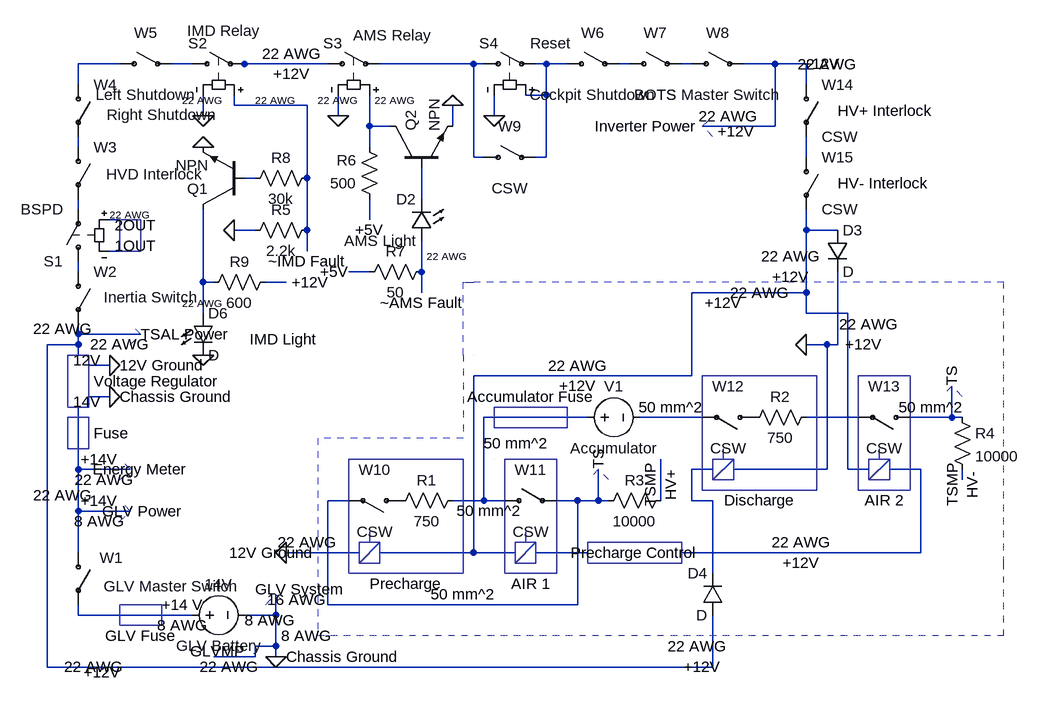
[diagram p0: schematic RM27 Shutdown Circuit 04_05_2024.asc]
RM27 Shutdown Circuit 04_05_2024.asc, the LTspice schematic file:
Version 4
SHEET 1 1548 680
WIRE 48 -672 -16 -672
WIRE 160 -672 128 -672
WIRE 240 -672 224 -672
WIRE 368 -672 240 -672
WIRE 592 -672 448 -672
WIRE 608 -672 592 -672
WIRE 704 -672 688 -672
WIRE 736 -672 704 -672
WIRE 832 -672 816 -672
WIRE 928 -672 912 -672
WIRE 1056 -672 1008 -672
WIRE 1104 -672 1056 -672
WIRE -16 -640 -16 -672
WIRE 1104 -640 1104 -672
WIRE 704 -624 704 -672
WIRE 704 -624 672 -624
WIRE 224 -608 224 -624
WIRE 336 -608 224 -608
WIRE 176 -592 176 -624
WIRE 384 -592 384 -624
WIRE 624 -592 624 -624
WIRE 432 -576 432 -624
WIRE 464 -576 432 -576
WIRE 560 -576 560 -608
WIRE 1056 -576 1056 -672
WIRE 1056 -576 944 -576
WIRE -16 -544 -16 -560
WIRE 432 -544 432 -576
WIRE 592 -528 592 -672
WIRE 608 -528 592 -528
WIRE 704 -528 704 -624
WIRE 704 -528 688 -528
WIRE 1104 -528 1104 -560
WIRE 256 -496 240 -496
WIRE 336 -496 336 -608
WIRE 512 -464 512 -512
WIRE -16 -448 -16 -464
WIRE 48 -432 32 -432
WIRE 432 -432 432 -464
WIRE 256 -416 224 -416
WIRE 336 -416 336 -496
WIRE 1104 -416 1104 -448
WIRE 1152 -416 1104 -416
WIRE 48 -384 32 -384
WIRE 336 -384 336 -416
WIRE -16 -352 -16 -368
WIRE 432 -352 400 -352
WIRE 512 -352 512 -400
WIRE 176 -336 176 -448
WIRE 192 -336 176 -336
WIRE 304 -336 272 -336
WIRE 512 -320 512 -352
WIRE 1104 -320 1104 -416
WIRE 1104 -320 928 -320
WIRE 176 -288 176 -336
WIRE 1104 -288 1104 -320
WIRE 1168 -288 1104 -288
WIRE -16 -256 -16 -272
WIRE 80 -256 -16 -256
WIRE -16 -240 -16 -256
WIRE -16 -240 -64 -240
WIRE 1136 -240 1104 -240
WIRE 1152 -240 1152 -352
WIRE 1152 -240 1136 -240
WIRE -16 -224 -16 -240
WIRE 32 -208 0 -208
WIRE 928 -192 928 -320
WIRE 928 -192 592 -192
WIRE 32 -160 0 -160
WIRE 768 -128 608 -128
WIRE 944 -128 848 -128
WIRE 1184 -128 1104 -128
WIRE 1328 -128 1328 -176
WIRE 1328 -128 1264 -128
WIRE 1344 -128 1328 -128
WIRE -16 -48 -16 -144
WIRE 64 -48 -16 -48
WIRE 960 -48 928 -48
WIRE 1136 -48 1136 -240
WIRE 1136 -48 992 -48
WIRE 1168 -48 1168 -288
WIRE 1200 -48 1168 -48
WIRE 1280 -48 1232 -48
WIRE 1344 -32 1344 -48
WIRE 400 0 368 0
WIRE 608 0 608 -128
WIRE 608 0 560 0
WIRE 640 0 608 0
WIRE 752 0 720 0
WIRE 784 0 784 -48
WIRE 784 0 752 0
WIRE 800 0 784 0
WIRE 880 0 880 -64
WIRE 928 0 928 -48
WIRE 960 0 928 0
WIRE -16 16 -16 -48
WIRE 64 16 -16 16
WIRE -16 80 -16 16
WIRE 416 80 304 80
WIRE 592 80 592 -192
WIRE 592 80 448 80
WIRE 656 80 592 80
WIRE 768 80 688 80
WIRE 1280 80 1280 -48
WIRE 1280 80 912 80
WIRE 960 112 960 0
WIRE 368 160 368 0
WIRE 752 160 752 0
WIRE 752 160 368 160
WIRE -16 176 -16 160
WIRE 160 176 -16 176
WIRE 288 176 288 144
WIRE 288 176 240 176
WIRE 288 224 288 176
WIRE 288 224 256 224
WIRE 256 240 256 224
WIRE 256 240 192 240
WIRE 288 240 288 224
WIRE -64 256 -64 -240
WIRE 960 256 960 176
WIRE 960 256 -64 256
FLAG 384 -592 0
FLAG 560 -608 0
FLAG 624 -592 0
FLAG 176 -592 0
FLAG 288 240 0
FLAG 1104 -240 0
FLAG 32 -208 0
FLAG 32 -160 0
FLAG 304 80 0
FLAG 224 -416 0
FLAG 176 -544 0
FLAG 176 -224 0
SYMBOL csw -16 80 R0
WINDOW 0 33 8 Left 2
WINDOW 3 39 52 Left 2
SYMATTR InstName W1
SYMATTR Value GLV Master Switch
SYMBOL csw -16 -352 R0
WINDOW 3 39 39 Left 2
SYMATTR Value Inertia Switch
SYMATTR InstName W2
SYMBOL sw -16 -352 R180
SYMATTR InstName S1
SYMATTR Value BSPD
SYMBOL csw -16 -544 R0
WINDOW 3 43 42 Left 2
SYMATTR Value HVD Interlock
SYMATTR InstName W3
SYMBOL csw -16 -640 R0
WINDOW 3 44 46 Left 2
SYMATTR Value Right Shutdown
SYMATTR InstName W4
SYMBOL csw 48 -672 R270
WINDOW 0 32 40 VTop 2
WINDOW 3 -32 40 VBottom 2
SYMATTR InstName W5
SYMATTR Value Left Shutdown
SYMBOL sw 144 -672 R270
WINDOW 0 32 9 VRight 2
WINDOW 3 35 64 VTop 2
SYMATTR InstName S2
SYMATTR Value IMD Relay
SYMBOL sw 352 -672 R270
WINDOW 0 32 9 VRight 2
WINDOW 3 44 55 VRight 2
SYMATTR InstName S3
SYMATTR Value AMS Relay
SYMBOL npn 464 -512 R270
SYMATTR InstName Q2
SYMBOL res 448 -448 R180
WINDOW 0 36 76 Left 2
WINDOW 3 36 40 Left 2
SYMATTR InstName R6
SYMATTR Value 500
SYMBOL LED 528 -400 R180
WINDOW 0 24 64 Left 2
WINDOW 3 24 0 Left 2
SYMATTR InstName D2
SYMATTR Value AMS Light
SYMBOL res 416 -336 R270
WINDOW 0 32 56 VTop 2
WINDOW 3 0 56 VBottom 2
SYMATTR InstName R7
SYMATTR Value 50
SYMBOL csw 736 -672 R270
WINDOW 0 32 40 VTop 2
WINDOW 3 -32 40 VBottom 2
SYMATTR InstName W6
SYMATTR Value Cockpit Shutdown
SYMBOL csw 832 -672 R270
WINDOW 0 32 40 VTop 2
WINDOW 3 -32 40 VBottom 2
SYMATTR InstName W7
SYMATTR Value BOTS
SYMBOL csw 608 -528 R270
WINDOW 0 32 40 VTop 2
WINDOW 3 -32 40 VBottom 2
SYMATTR InstName W9
SYMBOL sw 592 -672 R270
WINDOW 0 32 9 VRight 2
WINDOW 3 32 87 VRight 2
SYMATTR InstName S4
SYMATTR Value Reset
SYMBOL csw 928 -672 R270
WINDOW 0 32 40 VTop 2
WINDOW 3 -32 40 VBottom 2
SYMATTR InstName W8
SYMATTR Value TS Master Switch
SYMBOL voltage 144 176 R270
WINDOW 0 32 56 VTop 2
WINDOW 3 -32 56 VBottom 2
SYMATTR InstName 14V
SYMATTR Value GLV Battery
SYMBOL csw 480 0 R90
WINDOW 0 -32 40 VBottom 2
WINDOW 3 32 40 VTop 2
SYMATTR InstName W10
SYMBOL res 576 -16 R90
WINDOW 0 0 56 VBottom 2
WINDOW 3 32 56 VTop 2
SYMATTR InstName R1
SYMATTR Value 750
SYMBOL csw 640 0 R270
WINDOW 0 32 40 VTop 2
WINDOW 3 -32 40 VBottom 2
SYMATTR InstName W11
SYMBOL res 784 16 R270
WINDOW 0 32 56 VTop 2
WINDOW 3 0 56 VBottom 2
SYMATTR InstName R3
SYMATTR Value 10000
SYMBOL voltage 752 -128 R270
WINDOW 0 32 56 VTop 2
WINDOW 3 -32 56 VBottom 2
SYMATTR InstName V1
SYMATTR Value Accumulator
SYMBOL csw 1024 -128 R90
WINDOW 0 -32 40 VBottom 2
WINDOW 3 32 40 VTop 2
SYMATTR InstName W12
SYMBOL res 1120 -144 R90
WINDOW 0 0 56 VBottom 2
WINDOW 3 32 56 VTop 2
SYMATTR InstName R2
SYMATTR Value 750
SYMBOL csw 1264 -128 R90
WINDOW 0 -32 40 VBottom 2
WINDOW 3 32 40 VTop 2
SYMATTR InstName W13
SYMBOL res 1328 -144 R0
SYMATTR InstName R4
SYMATTR Value 10000
SYMBOL diode 1136 -416 R0
SYMATTR InstName D3
SYMBOL diode 976 176 R180
WINDOW 0 24 64 Left 2
WINDOW 3 24 0 Left 2
SYMATTR InstName D4
SYMBOL res 240 -400 R270
WINDOW 0 32 56 VTop 2
WINDOW 3 0 56 VBottom 2
SYMATTR InstName R5
SYMATTR Value 2.2k
SYMBOL csw 1104 -640 R0
SYMATTR InstName W14
SYMBOL csw 1104 -528 R0
SYMATTR InstName W15
SYMBOL res 352 -512 R90
WINDOW 0 0 56 VBottom 2
WINDOW 3 32 56 VTop 2
SYMATTR InstName R8
SYMATTR Value 30k
SYMBOL npn 240 -448 R180
SYMATTR InstName Q1
SYMBOL res 288 -352 R90
WINDOW 0 0 56 VBottom 2
WINDOW 3 32 56 VTop 2
SYMATTR InstName R9
SYMATTR Value 600
SYMBOL LED 160 -288 R0
SYMATTR InstName D6
TEXT 432 -432 Top 2 !+5V
TEXT 400 -352 Right 2 !+5V
TEXT 512 -320 Top 2 !~AMS Fault
TEXT 144 16 Right 2 !GLV Power
TEXT 152 -48 Right 2 !Energy Meter
TEXT 16 -48 Bottom 2 !+14V
TEXT 16 16 Bottom 2 !+14V
TEXT 144 176 Bottom 2 !+14 V
TEXT 304 240 Left 2 !Chassis Ground
TEXT 296 208 Left 2 !8 AWG
TEXT 240 232 Right 2 !GLVMP
TEXT 216 240 Top 2 !22 AWG
TEXT 144 176 Top 2 !8 AWG
TEXT 24 -48 Top 2 !22 AWG
TEXT 16 16 Top 2 !8 AWG
TEXT 312 -672 Bottom 2 !22 AWG
TEXT 320 168 Bottom 2 !16 AWG
TEXT 880 -24 VBottom 2 !TSMP
TEXT 880 -24 VTop 2 !HV+
TEXT 784 -48 VLeft 2 !TS
TEXT 488 112 Top 2 !Precharge
TEXT 680 -144 Bottom 2 !Accumulator Fuse
TEXT 680 112 Top 2 !AIR 1
TEXT 840 80 Center 2 !Precharge Control
TEXT 1032 -16 Top 2 !Discharge
TEXT 1224 -16 Top 2 !AIR 2
TEXT 1344 -24 VBottom 2 !TSMP
TEXT 1344 -24 VTop 2 !HV-
TEXT 1328 -176 VLeft 2 !TS
TEXT 336 -384 Top 2 !~IMD Fault
TEXT 80 192 Top 2 !GLV Fuse
TEXT 576 160 Bottom 2 !50 mm^2
TEXT 608 -88 Left 2 !50 mm^2
TEXT 1296 -128 Bottom 2 !50 mm^2
TEXT 616 0 Top 2 !50 mm^2
TEXT 896 -128 Bottom 2 !50 mm^2
TEXT 1152 -600 Left 2 !HV+ Interlock
TEXT 1152 -488 Left 2 !HV- Interlock
TEXT 968 -568 Left 2 !+12V
TEXT 80 -256 Left 2 !TSAL Power
TEXT 48 -256 Top 2 !22 AWG
TEXT 312 -672 Top 2 !+12V
TEXT 40 -424 Left 2 !2OUT
TEXT 40 -392 Left 2 !1OUT
TEXT 1080 -360 Top 2 !+12V
TEXT 1096 80 Top 2 !+12V
TEXT 944 240 Top 2 !+12V
TEXT 1128 -688 Top 2 !+12V
TEXT 256 136 Left 2 !GLV System
TEXT 240 184 Left 2 !8 AWG
TEXT 936 -576 Right 2 !Inverter Power
TEXT 8 -184 Left 2 !Voltage Regulator
TEXT 752 -192 Top 2 !+12V
TEXT 1192 -256 Top 2 !+12V
TEXT 976 -320 Top 2 !+12V
TEXT -8 264 Left 2 !+12V
TEXT -24 -152 Left 2 !14V
TEXT -24 -216 Left 2 !12V
TEXT 48 -208 Left 2 !12V Ground
TEXT 48 -160 Left 2 !Chassis Ground
TEXT 216 80 Left 2 !12V Ground
TEXT 8 -104 Left 2 !Fuse
TEXT 312 -336 Left 2 !+12V
TEXT 248 -248 Left 2 !IMD Light
TEXT 144 -616 Left 1 !22 AWG
TEXT 256 -616 Left 1 !22 AWG
TEXT 144 -304 Left 1 !22 AWG
TEXT 352 -616 Left 1 !22 AWG
TEXT 440 -616 Left 1 !22 AWG
TEXT 520 -376 Left 1 !22 AWG
TEXT 32 -440 Left 1 !22 AWG
TEXT -40 -24 Top 2 !22 AWG
TEXT -40 -280 Top 2 !22 AWG
TEXT 984 -576 Bottom 2 !22 AWG
TEXT 1136 -656 Bottom 2 !22 AWG
TEXT 1080 -360 Bottom 2 !22 AWG
TEXT 1200 -256 Bottom 2 !22 AWG
TEXT 1032 -304 Bottom 2 !22 AWG
TEXT 1096 80 Bottom 2 !22 AWG
TEXT 752 -192 Bottom 2 !22 AWG
TEXT 936 240 Bottom 2 !22 AWG
TEXT 336 80 Bottom 2 !22 AWG
TEXT 8 240 Top 2 !22 AWG
LINE Normal 416 96 448 64
LINE Normal 432 48 432 64
LINE Normal 432 48 432 48 2
LINE Normal 656 96 688 64
LINE Normal 624 -64 624 -64 2
LINE Normal 672 64 672 48
LINE Normal 784 -48 768 -32 2
LINE Normal 800 -32 784 -48 2
LINE Normal 960 -32 992 -64
LINE Normal 976 -80 976 -64
LINE Normal 976 -80 976 -80 2
LINE Normal 1216 -64 1216 -80
LINE Normal 1328 -176 1312 -160 2
LINE Normal 1344 -160 1328 -176 2
LINE Normal 1232 -32 1232 -32 2
LINE Normal 1200 -32 1232 -64
LINE Normal 1408 96 1408 -224 2
LINE Normal 1408 208 1408 96 2
LINE Normal 352 -96 352 208 2
LINE Normal 576 -96 352 -96 2
LINE Normal 576 -224 576 -96 2
LINE Normal 592 -224 592 -224 2
LINE Normal 576 -336 592 -336 2
LINE Normal 576 -224 576 -336 2
LINE Normal 1408 -224 1408 -336 2
LINE Normal 80 -256 64 -272 2
LINE Normal 64 -240 80 -256 2
LINE Normal 1408 208 352 208 2
LINE Normal 1408 -336 592 -336 2
LINE Normal 944 -576 960 -592 2
LINE Normal 960 -560 944 -576 2
LINE Normal 64 -48 48 -64 2
LINE Normal 48 -32 64 -48 2
LINE Normal 64 16 48 0 2
LINE Normal 48 32 64 16 2
LINE Normal 288 144 304 160 2
LINE Normal 272 160 288 144 2
RECTANGLE Normal 80 -432 48 -384
RECTANGLE Normal 448 96 416 64
RECTANGLE Normal 688 96 656 64
RECTANGLE Normal 400 -64 400 -64 2
RECTANGLE Normal 736 -112 624 -144
RECTANGLE Normal 720 112 640 -64
RECTANGLE Normal 576 112 400 -64
RECTANGLE Normal 912 96 768 64
RECTANGLE Normal 992 -32 960 -64
RECTANGLE Normal 944 -192 944 -192 2
RECTANGLE Normal 1120 -16 944 -192
RECTANGLE Normal 1232 -32 1200 -64
RECTANGLE Normal 1264 -16 1184 -192
RECTANGLE Normal 112 192 48 160
RECTANGLE Normal 0 -144 -32 -224
RECTANGLE Normal 0 -80 -32 -128

The netlist it stands for:
* RM27 Shutdown Circuit 04_05_2024.asc
W1 N030 N037 GLV Master Switch
W2 N020 N025 Inertia Switch
S1 N020 N015 N016 N019 BSPD
W3 N011 N015 HVD Interlock
W4 N001 N011 Right Shutdown
W5 N001 N002 Left Shutdown
S2 N002 N003 N009 0 IMD Relay
S3 N003 N004 N010 0 AMS Relay
Q2 N010 N014 0 0 NPN
R6 N017 N010 500
D2 N022 N014 AMS Light
R7 N021 N022 50
W6 N005 N006 Cockpit Shutdown
W7 N006 N007 BOTS
W9 N004 N005 CSW
S4 N004 N005 N005 0 Reset
W8 N007 N008 TS Master Switch
V§14V N037 0 GLV Battery
W10 P001 N034 CSW
R1 N026 P001 750
W11 N026 N034 CSW
R3 N034 N035 10000
V1 N026 N027 Accumulator
W12 P002 N027 CSW
R2 N028 P002 750
W13 N029 N028 CSW
R4 N029 N033 10000
D3 N018 0 D
D4 N025 N031 D
R5 0 N009 2.2k
W14 N008 N012 CSW
W15 N012 N018 CSW
R8 N009 N013 30k
Q1 N023 N013 0 0 NPN
R9 N024 N023 600
D6 N023 0 D
.model D D
.lib standard.dio
.model NPN NPN
.model PNP PNP
.lib standard.bjt
+5V
+5V
~AMS Fault
GLV Power
Energy Meter
+14V
+14V
+14 V
Chassis Ground
8 AWG
GLVMP
22 AWG
8 AWG
22 AWG
8 AWG
22 AWG
16 AWG
TSMP
HV+
TS
Precharge
Accumulator Fuse
AIR 1
Precharge Control
Discharge
AIR 2
TSMP
HV-
TS
~IMD Fault
GLV Fuse
50 mm^2
50 mm^2
50 mm^2
50 mm^2
50 mm^2
HV+ Interlock
HV- Interlock
+12V
TSAL Power
22 AWG
+12V
2OUT
1OUT
+12V
+12V
+12V
+12V
GLV System
8 AWG
Inverter Power
Voltage Regulator
+12V
+12V
+12V
+12V
14V
12V
12V Ground
Chassis Ground
12V Ground
Fuse
+12V
IMD Light
22 AWG
22 AWG
22 AWG
22 AWG
22 AWG
22 AWG
22 AWG
22 AWG
22 AWG
22 AWG
22 AWG
22 AWG
22 AWG
22 AWG
22 AWG
22 AWG
22 AWG
22 AWG
22 AWG
.backanno
.end